# Altium schematic sheet OLED_DISPLAY.SchDoc
size A4
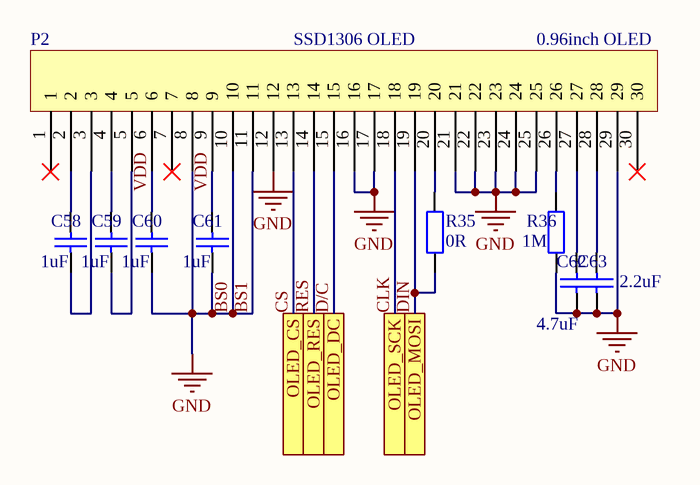
[diagram p0: OLED_DISPLAY.SchDoc]

## Parts
C58  value 1uF  [0603_CAP_NPOL]  (hidden comment: Cap)
C59  value 1uF  [0603_CAP_NPOL]  (hidden comment: Cap)
C60  value 1uF  [0603_CAP_NPOL]  (hidden comment: Cap)
C61  value 1uF  [0603_CAP_NPOL]  (hidden comment: Cap)
C62  value 4.7uF  [0603_CAP_NPOL]  (hidden comment: Cap)
C63  value 2.2uF  [0603_CAP_NPOL]  (hidden comment: Cap)
P2  0.96inch OLED  [SSD1306_OLED]
R35  value 0R  [0402_RES]  (hidden comment: Res2)
R36  value 1M  [0402_RES]  (hidden comment: Res2)

## Ports
OLED_CS, OLED_DC, OLED_MOSI, OLED_RES, OLED_SCK

## Nets
BS0: C60.1 C61.1 C62.1 C63.1 P2.8 P2.10 P2.11 P2.12 P2.16 P2.17 P2.21 P2.22 P2.23 P2.24 P2.25 P2.29 R36.1  [also labelled BS1, GND]
CLK: P2.18 ; port OLED_SCK
CS: P2.13 ; port OLED_CS
D/C: P2.15 ; port OLED_DC
DIN: P2.19 R35.1 ; port OLED_MOSI
RES: P2.14 ; port OLED_RES
VDD: C60.2 C61.2 P2.6 P2.9
NetC58_1: C58.1 P2.3
NetC58_2: C58.2 P2.2
NetC59_1: C59.1 P2.5
NetC59_2: C59.2 P2.4
NetC62_2: C62.2 P2.27
NetC63_2: C63.2 P2.28
NetP2_20: P2.20 R35.2
NetP2_26: P2.26 R36.2

Not connected (* = marked no-connect by the designer): P2 1* 7* 30*

## Library data of the parts
C58-C63 = Cap: Capacitor; Published: 8-Jun-2000; LatestRevisionDate: 17-Jul-2002; LatestRevisionNote: Re-released for DXP Platform.; PackageReference: RAD-0.3; Publisher: Altium Limited; PackageDescription: Radial Cap, Thru-Hole; 2 Leads; 0.3 in Pin Spacing
P2 = SSD1306 OLED: Name: SSD1306 OLED
R35 R36 = Res2: Resistor; Published: 8-Jun-2000; LatestRevisionDate: 17-Jul-2002; LatestRevisionNote: Re-released for DXP Platform.; PackageReference: AXIAL-0.4; Publisher: Altium Limited; PackageDescription: Axial Device, Thru-Hole; 2 Leads; 0.4 in Pin Spacing